# EAGLE design Xtriker_Laser (EAGLE 9.6.0)
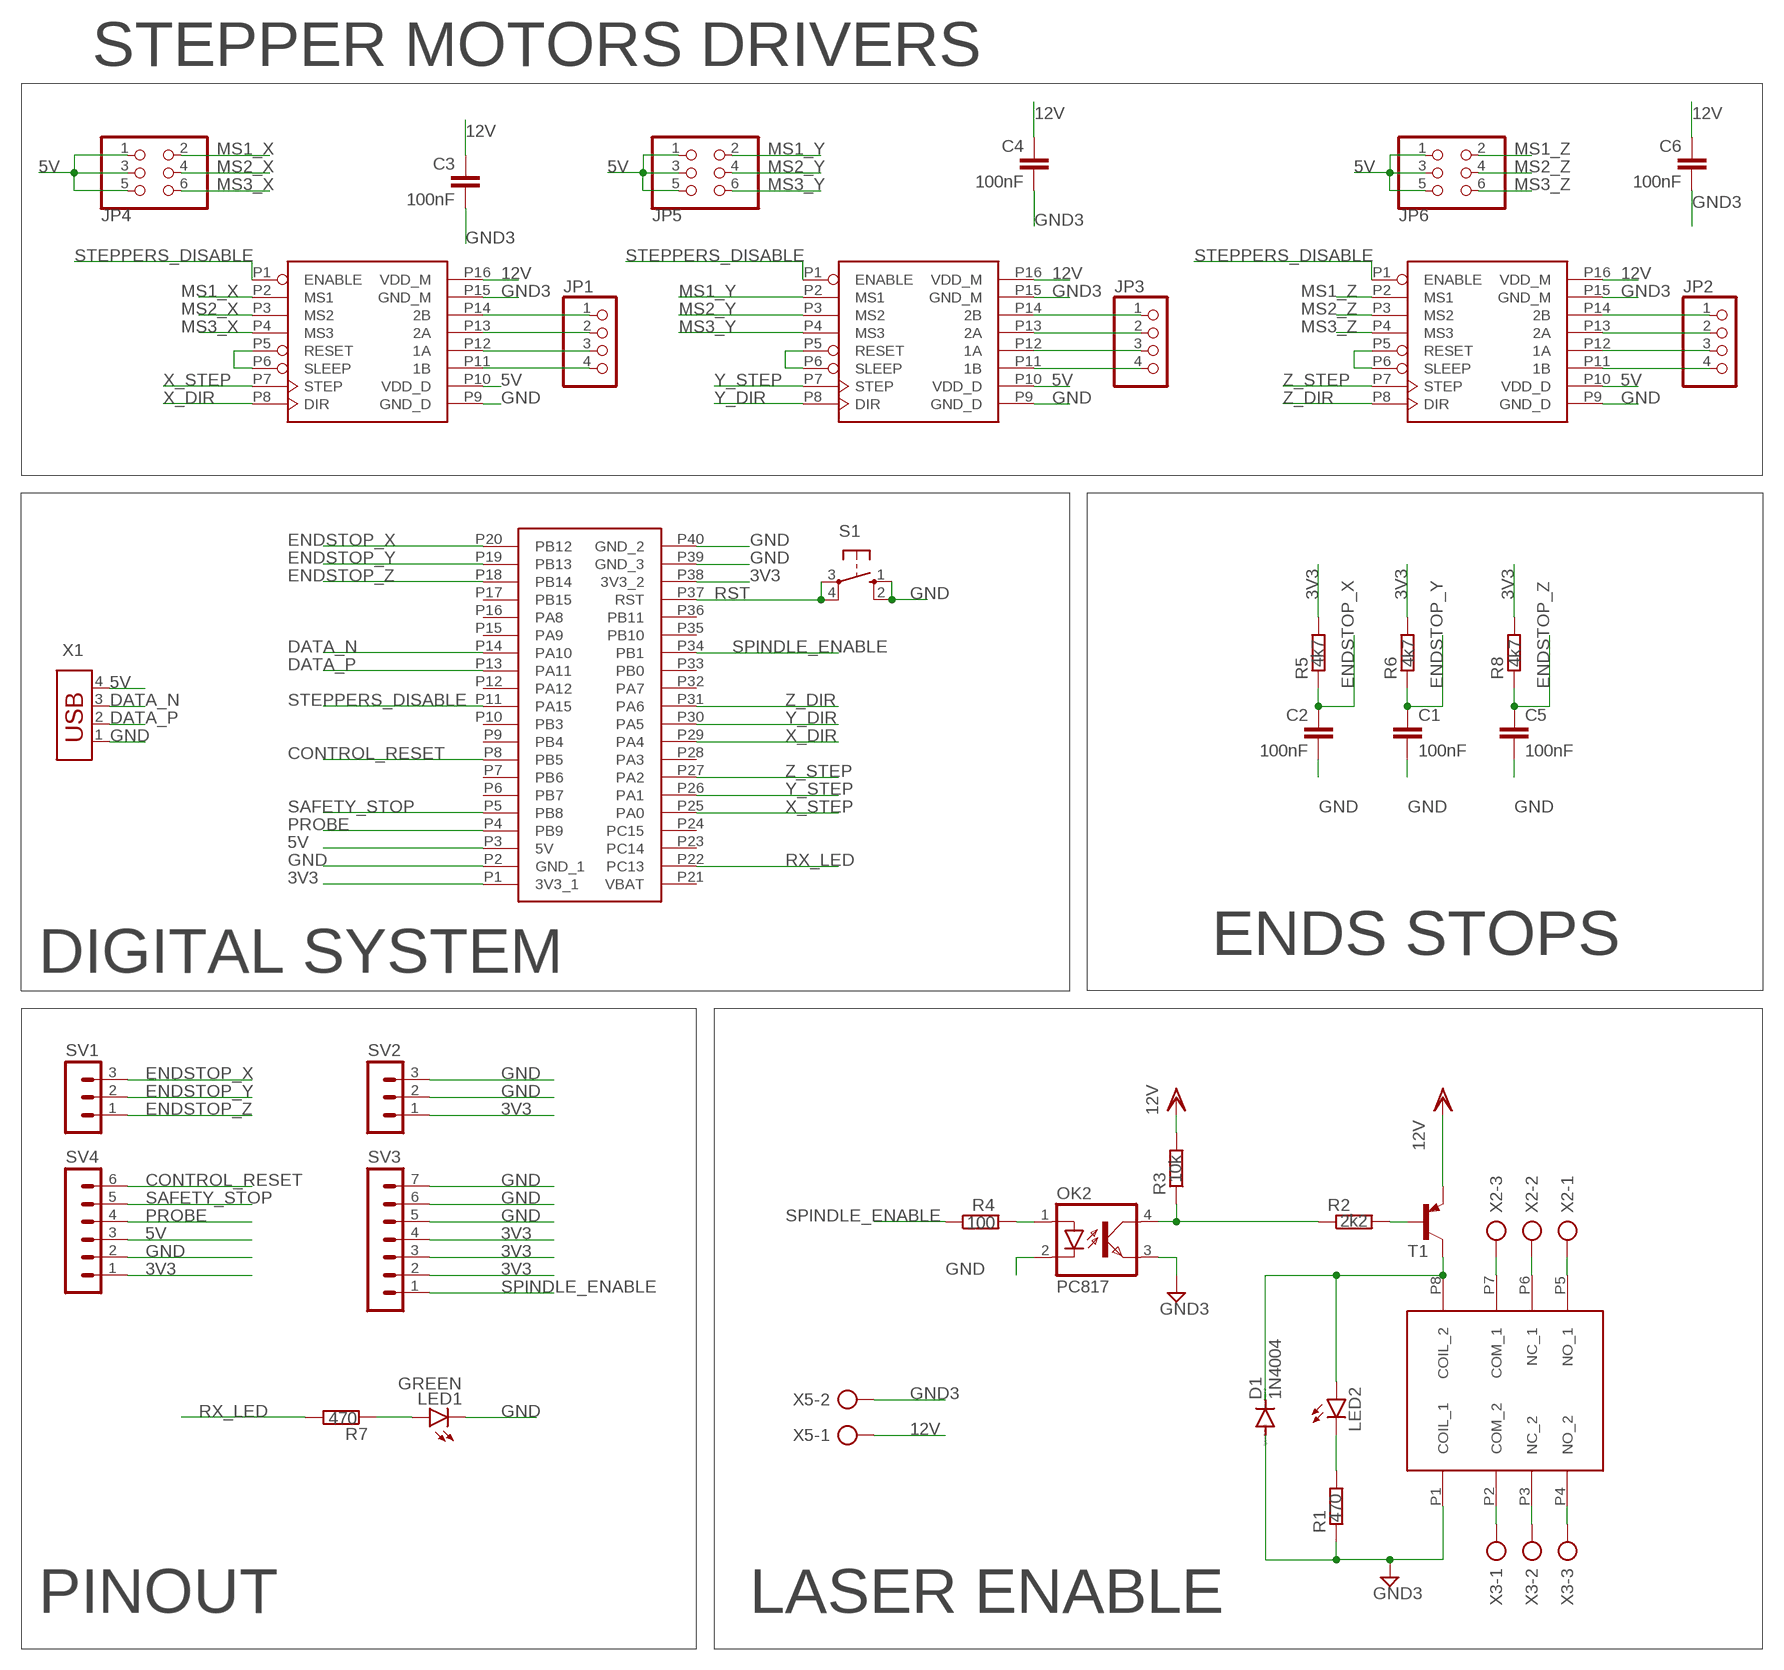
[diagram p0: schematic, sheet 1]

## Parts
C1  100nF  C-EUC0805  [C0805]
C2  100nF  C-EUC0805  [C0805]
C3  100nF  C-EUC0805  [C0805]
C4  100nF  C-EUC0805  [C0805]
C5  100nF  C-EUC0805  [C0805]
C6  100nF  C-EUC0805  [C0805]
D1  1N4004  [DO41-10]
JP1  PINHD-1X4  [1X04]
JP2  PINHD-1X4  [1X04]
JP3  PINHD-1X4  [1X04]
JP4  PINHD-2X3  [2X03]
JP5  PINHD-2X3  [2X03]
JP6  PINHD-2X3  [2X03]
LED1  GREEN  LED3MM  [LED3MM]
LED2  LED3MM  [LED3MM]
OK2  PC817  [DIL04]
R1  470  R-EU_R0805  [R0805]
R2  2k2  R-EU_R0805  [R0805]
R3  10k  R-EU_R0805  [R0805]
R4  100  R-EU_R0805  [R0805]
R5  4k7  R-EU_R0805  [R0805]
R6  4k7  R-EU_R0805  [R0805]
R7  470  R-EU_R0805  [R0805]
R8  4k7  R-EU_R0805  [R0805]
S1  10-XX  [B3F-10XX]
SV1  MA03-1  [MA03-1]
SV2  MA03-1  [MA03-1]
SV3  MA07-1  [MA07-1]
SV4  MA06-1  [MA06-1]
T1  -PNP-SOT23-BCE  [SOT23-BCE]
U$1  A4988  [A4988]
U$2  A4988  [A4988]
U$3  A4988  [A4988]
U$4  BLUEPILL_STM32F103C8  [BLUEPILL_STM32F103C8]
U$5  TDS-1202L  [TDS_1202L]
X1  USB-787616  [USB]
X2  AK500/3  [AK500/3]
X3  AK500/3  [AK500/3]
X5  AK500/2  [AK500/2]

## Nets
3V3: R5.2 R6.2 R8.2 SV2.1 SV3.2 SV3.3 SV3.4 SV4.1 U$4.P1(3V3_1) U$4.P38(3V3_2)
5V: JP4.1 JP4.3 JP4.5 JP5.1 JP5.3 JP5.5 JP6.1 JP6.3 JP6.5 SV4.3 U$1.P10(VDD_D) U$2.P10(VDD_D) U$3.P10(VDD_D) U$4.P3(5V) X1.4
12V: C3.1 C4.1 C6.1 U$1.P16(VDD_M) U$2.P16(VDD_M) U$3.P16(VDD_M) X5.1
CONTROL_RESET: SV4.6 U$4.P8(PB5)
DATA_N [Diff]: U$4.P14(PA10) X1.3
DATA_P [Diff]: U$4.P13(PA11) X1.2
ENDSTOP_X: C2.1 R5.1 SV1.3 U$4.P20(PB12)
ENDSTOP_Y: C1.1 R6.1 SV1.2 U$4.P19(PB13)
ENDSTOP_Z: C5.1 R8.1 SV1.1 U$4.P18(PB14)
GND: C1.2 C2.2 C5.2 LED1.K(C) OK2.2(C) S1.1(S) S1.2(S1) SV2.2 SV2.3 SV3.5 SV3.6 SV3.7 SV4.2 U$1.P9(GND_D) U$2.P9(GND_D) U$3.P9(GND_D) U$4.P2(GND_1) U$4.P39(GND_3) U$4.P40(GND_2) X1.1
GND3: C3.2 C4.2 C6.2 D1.A OK2.3(EMIT) R1.1 U$1.P15(GND_M) U$2.P15(GND_M) U$3.P15(GND_M) U$5.P1(COIL_1) X5.2
MS1_X: JP4.2 U$1.P2(MS1)
MS1_Y: JP5.2 U$3.P2(MS1)
MS1_Z: JP6.2 U$2.P2(MS1)
MS2_X: JP4.4 U$1.P3(MS2)
MS2_Y: JP5.4 U$3.P3(MS2)
MS2_Z: JP6.4 U$2.P3(MS2)
MS3_X: JP4.6 U$1.P4(MS3)
MS3_Y: JP5.6 U$3.P4(MS3)
MS3_Z: JP6.6 U$2.P4(MS3)
N$1: JP2.4 U$2.P11(1B)
N$2: JP2.3 U$2.P12(1A)
N$3: JP2.2 U$2.P13(2A)
N$4: JP2.1 U$2.P14(2B)
N$5: JP3.4 U$3.P11(1B)
N$6: JP3.3 U$3.P12(1A)
N$7: JP3.2 U$3.P13(2A)
N$8: JP3.1 U$3.P14(2B)
N$9: JP1.4 U$1.P11(1B)
N$10: JP1.3 U$1.P12(1A)
N$11: JP1.2 U$1.P13(2A)
N$13: D1.C LED2.A T1.C U$5.P8(COIL_2)
N$14: LED2.K(C) R1.2
N$15: R2.2 T1.B
N$16: OK2.4(COL) R2.1 R3.1
N$17: OK2.1(A) R4.2
N$26: U$1.P5(RESET) U$1.P6(SLEEP)
N$27: U$3.P5(RESET) U$3.P6(SLEEP)
N$28: U$2.P5(RESET) U$2.P6(SLEEP)
N$29: U$5.P5(NO_1) X2.1
N$30: U$5.P6(NC_1) X2.2
N$31: U$5.P7(COM_1) X2.3
N$32: U$5.P4(NO_2) X3.3
N$33: U$5.P3(NC_2) X3.2
N$34: U$5.P2(COM_2) X3.1
N$35: LED1.A R7.1
PROBE: SV4.4 U$4.P4(PB9)
RST: S1.3(P) S1.4(P1) U$4.P37(RST)
RX_LED: R7.2 U$4.P22(PC13)
SAFETY_STOP: SV4.5 U$4.P5(PB8)
SMX_2B: JP1.1 U$1.P14(2B)
SPINDLE_ENABLE: R4.1 SV3.1 U$4.P34(PB1)
STEPPERS_DISABLE: U$1.P1(ENABLE) U$2.P1(ENABLE) U$3.P1(ENABLE) U$4.P11(PA15)
VDD: R3.2 T1.E ; supply symbol labelled 12V
X_DIR: U$1.P8(DIR) U$4.P29(PA4)
X_STEP: U$1.P7(STEP) U$4.P25(PA0)
Y_DIR: U$3.P8(DIR) U$4.P30(PA5)
Y_STEP: U$3.P7(STEP) U$4.P26(PA1)
Z_DIR: U$2.P8(DIR) U$4.P31(PA6)
Z_STEP: U$2.P7(STEP) U$4.P27(PA2)
Unconnected: U$4.P6(PB7) U$4.P7(PB6) U$4.P9(PB4) U$4.P10(PB3) U$4.P12(PA12) U$4.P15(PA9) U$4.P16(PA8) U$4.P17(PB15) U$4.P23(PC14) U$4.P24(PC15) U$4.P28(PA3) U$4.P32(PA7) U$4.P33(PB0) U$4.P35(PB10) U$4.P36(PB11)

## Notes on the sheet
- STEPPER MOTORS DRIVERS
- DIGITAL SYSTEM | ENDS STOPS
- PINOUT | LASER ENABLE

## Power pins joined to a net without a drawn wire
VBAT: U$4.P21(VBAT)

## Library data of the parts
C1-C6 = rcl:C-EU: CAPACITOR, European symbol; SPICEPREFIX: C
D1 = diode:1N4004: DIODE general purpose rectifier, 1 A
JP1-JP3 = pinhead:PINHD-1X4: PIN HEADER
JP4-JP6 = pinhead:PINHD-2X3: PIN HEADER
LED1 LED2 = led:LED: LED OSRAM: - CHIPLED LG R971, LG N971, LY N971, LG Q971, LY Q971, LO R971, LY R971 LH N974, LH R974 LS Q976, LO Q976, LY Q976 LO Q996 - Hyper CHIPLED LW Q18S LB Q993, LB Q99A, LB R99A - SideLED LS A670, LO A670, LY A670, LG A670, LP A670 LB A673, LV A673, LT A673, LW A673 LH A674 LY A675 LS A676, LA A676, LO A676, LY A676, LW A676 LS A679, LY A679, LG A679 - Hyper Micro SIDELED® LS Y876, LA Y876, LO Y876, LY Y876 LT Y87S - SmartLED LW L88C, LW L88S LB L89C, LB L89S, LG L890 LS L89K, LO L89K, LY L89K LS L896, LA L896, LO L896, LY L896 - TOPLED LS T670, LO T670, LY T670, LG T670, LP T670 LSG T670, LSP T670, LSY T670, LOP T670, LYG T670 LG T671, LOG T671, LSG T671 LB T673, LV T673, LT T673, LW T673 LH T674 LS T676, LA T676, LO T676, LY T676, LB T676, LH T676, LSB T676, LW T676 LB T67C, LV T67C, LT T67C, LS T67K, LO T67K, LY T67K, LW E67C LS E67B, LA E67B, LO E67B, LY E67B, LB E67C, LV E67C, LT E67C LW T67C LS T679, LY T679, LG T679 LS T770, LO T770, LY T770, LG T770, LP T770 LB T773, LV T773, LT T773, LW T773 LH T774 LS E675, LA E675, LY E675, LS T675 LS T776, LA T776, LO T776, LY T776, LB T776 LHGB T686 LT T68C, LB T68C - Hyper Mini TOPLED® LB M676 - Mini TOPLED Santana® LG M470 LS M47K, LO M47K, LY M47K Source: http://www.osram.convergy.de LUXEON: - LUMILED® LXK2-PW12-R00, LXK2-PW12-S00, LXK2-PW14-U00, LXK2-PW14-V00 LXK2-PM12-R00, LXK2-PM12-S00, LXK2-PM14-U00 LXK2-PE12-Q00, LXK2-PE12-R00, LXK2-PE12-S00, LXK2-PE14-T00, LXK2-PE14-U00 LXK2-PB12-K00, LXK2-PB12-L00, LXK2-PB12-M00, LXK2-PB14-N00, LXK2-PB14-P00, LXK2-PB14-Q00 LXK2-PR12-L00, LXK2-PR12-M00, LXK2-PR14-Q00, LXK2-PR14-R00 LXK2-PD12-Q00, LXK2-PD12-R00, LXK2-PD12-S00 LXK2-PH12-R00, LXK2-PH12-S00 LXK2-PL12-P00, LXK2-PL12-Q00, LXK2-PL12-R00 Source: www.luxeon.com KINGBRIGHT: KA-3528ASYC Source: www.kingbright.com
OK2 = optocoupler:PC817: SHARP OPTO COUPLER; MPN: PC817X4J000F; OC_FARNELL: 9707727; OC_NEWARK: 97K7059
R1-R8 = rcl:R-EU_: RESISTOR, European symbol; SPICEPREFIX: R
S1 = switch-omron:10-XX: OMRON SWITCH; MPN: B3F-1000; OC_FARNELL: 176432; OC_NEWARK: 36M3542
SV1 SV2 = con-lstb:MA03-1: PIN HEADER; OC_FARNELL: unknown; OC_NEWARK: unknown
SV3 = con-lstb:MA07-1: PIN HEADER; OC_FARNELL: unknown; OC_NEWARK: unknown
SV4 = con-lstb:MA06-1: PIN HEADER; OC_FARNELL: unknown; OC_NEWARK: unknown
T1 = transistor:*-PNP-: PNP Transistror
U$1-U$3 = A4988:A4988
U$4 = BluePill_STM32F103:BLUEPILL_STM32F103C8
U$5 = TDS-1202L:TDS-1202L
X1 = con-amp:USB-787616: AMP connector
X2 X3 = con-ptr500:AK500/3: CONNECTOR; OC_FARNELL: unknown; OC_NEWARK: unknown
X5 = con-ptr500:AK500/2: CONNECTOR; OC_FARNELL: unknown; OC_NEWARK: unknown

## Net classes
1 Diff: width 1.27 mm

## Board
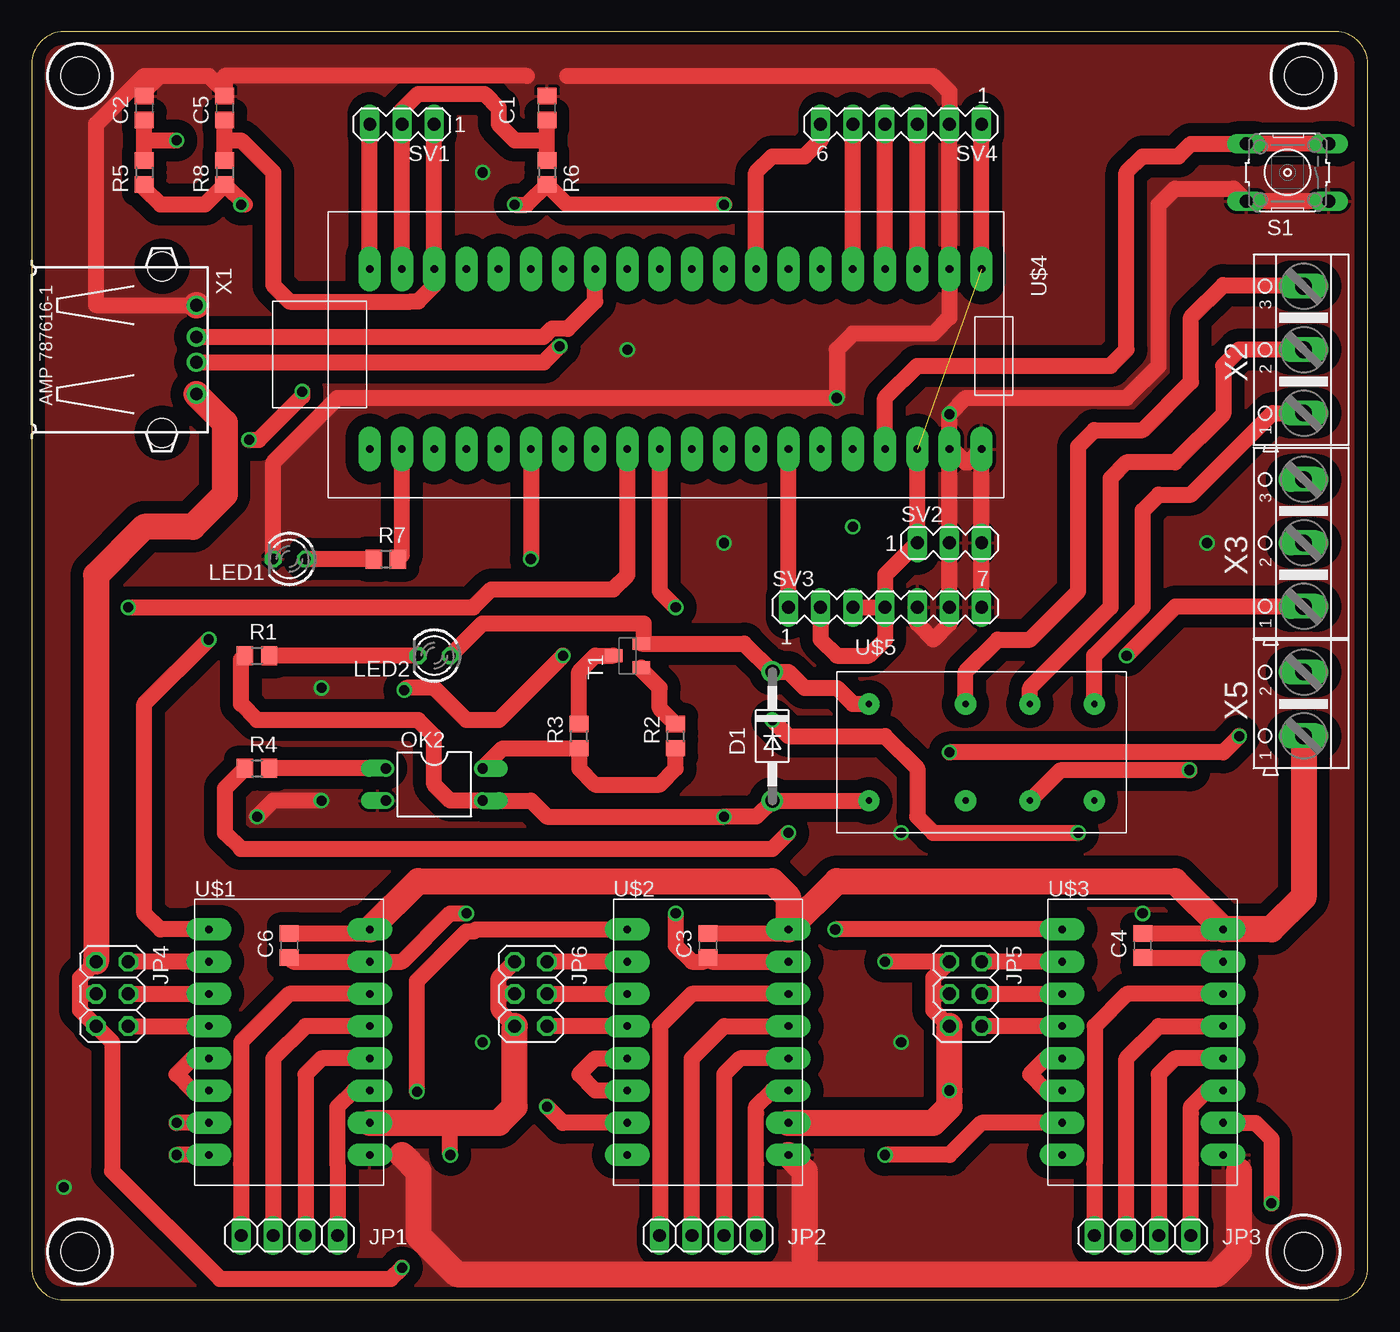
[diagram p1: board, top side]
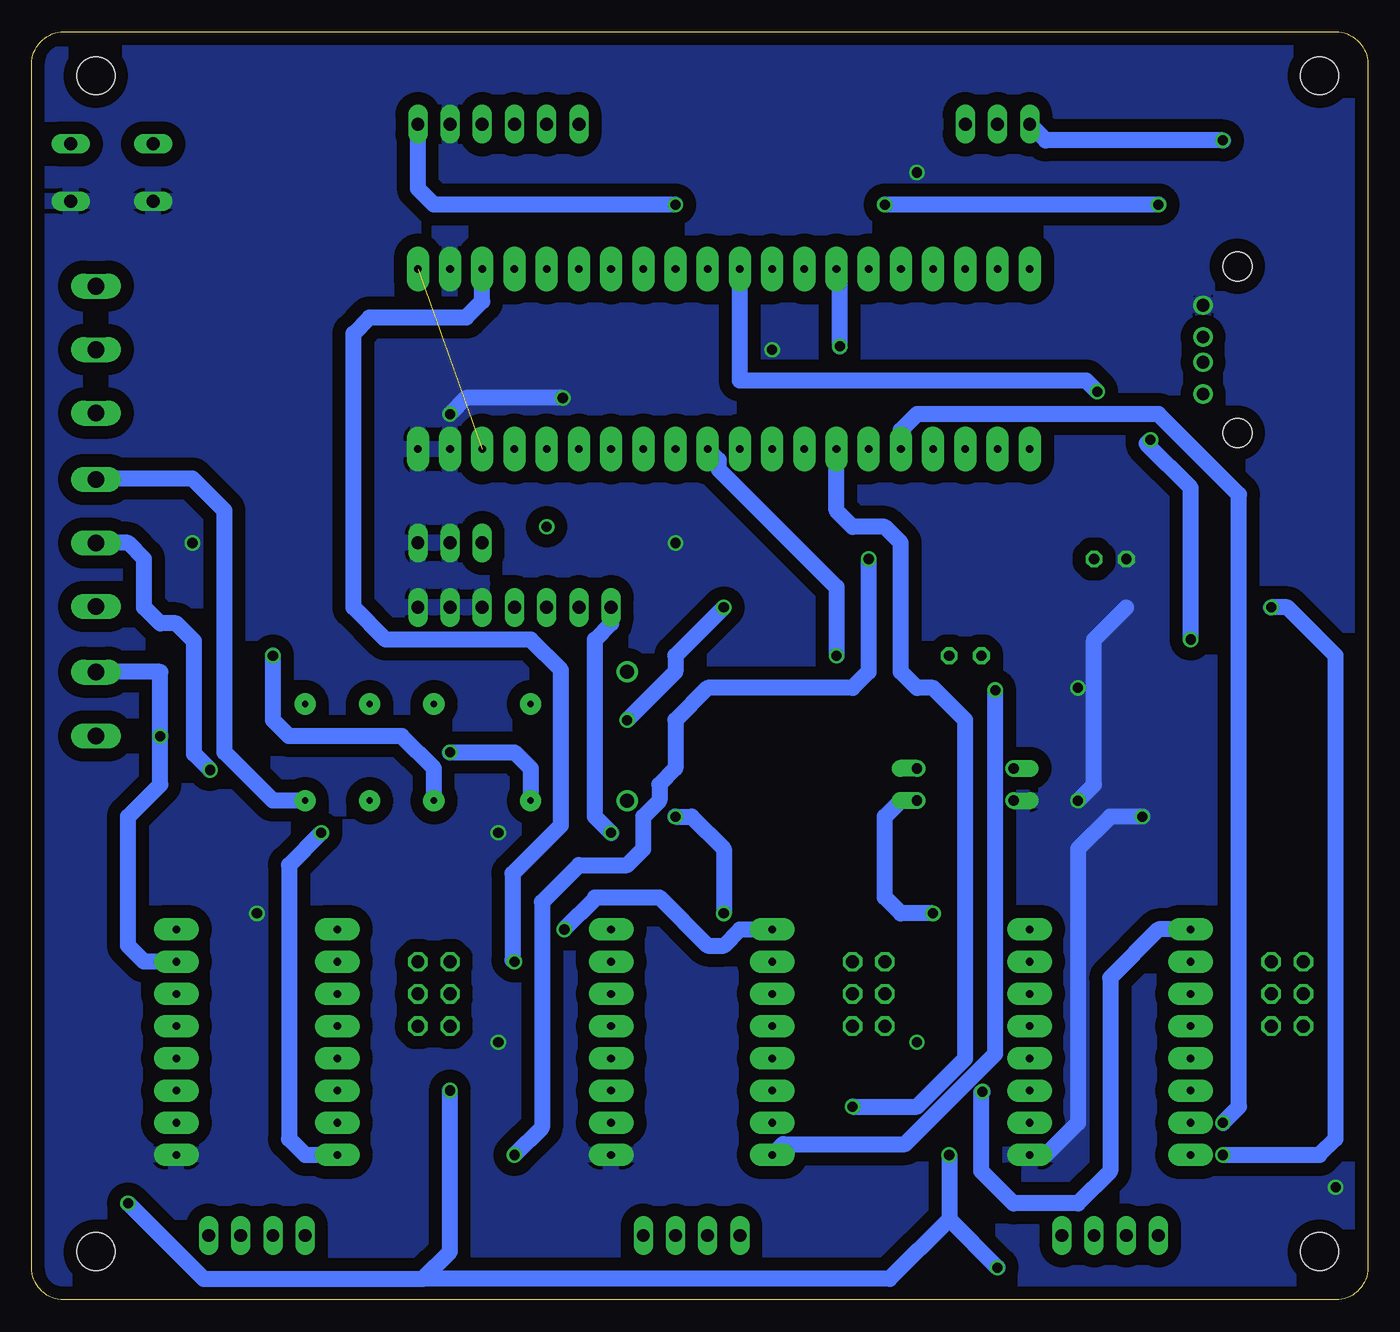
[diagram p2: board, bottom side, seen from below]

Size 105.39 x 100 mm. Coordinates in mm from the lower left corner, seen from the top.
Outline: 2.54,0 102.85,0 arc90 105.39,2.54 105.39,97.46 arc90 102.85,100 2.54,100 arc90 0,97.46 0,2.54 arc90 2.54,0
Copper layers (1*16): Top 0.035mm / dielectric 1.5mm / Bottom 0.035mm
Design rules "default *": minimum track width 6mil, minimum drill 0.8mm, track to track 6mil, track to pad 6mil, pad to pad 6mil, via to via 6mil, smd to smd 6mil, copper to edge 40mil, drill to drill 6mil, minimum pad ring 10mil, minimum via ring 8mil, stop-mask expansion 4mil, vias tented up to drill 0mil, thermal gap 10mil
Holes 3 mm at 100.33,96.52 100.33,3.81 3.81,3.81 3.81,96.52

### Footprints (pad centres in the part's own frame; a part is rotated, then mirrored left to right if it is on the bottom)
C0805 = smd 1.3 x 1.5: 1 -0.95,0; 2 0.95,0
DO41-10 = drill 1.118: A 5.08,0; C -5.08,0
1X04 = drill 1.016 long: 1 -3.81,0; 2 -1.27,0; 3 1.27,0; 4 3.81,0
2X03 = drill 1.016 octagon: 1 -2.54,-1.27; 2 -2.54,1.27; 3 0,-1.27; 4 0,1.27; 5 2.54,-1.27; 6 2.54,1.27
LED3MM = drill 0.813 octagon: A -1.27,0; K 1.27,0
DIL04 = drill 0.813 offset: 1 -1.27,-3.81; 2 1.27,-3.81; 3 1.27,3.81; 4 -1.27,3.81
R0805 = smd 1.3 x 1.5: 1 -0.95,0; 2 0.95,0
B3F-10XX = drill 1.016 long: 1 -3.251,2.261; 2 3.251,2.261; 3 -3.251,-2.261; 4 3.251,-2.261
MA03-1 = drill 1.016 long: 1 -2.54,0; 2 0,0; 3 2.54,0
MA07-1 = drill 1.016 long: 1 -7.62,0; 2 -5.08,0; 3 -2.54,0; 4 0,0; 5 2.54,0; 6 5.08,0; 7 7.62,0
MA06-1 = drill 1.016 long: 1 -6.35,0; 2 -3.81,0; 3 -1.27,0; 4 1.27,0; 5 3.81,0; 6 6.35,0
SOT23-BCE = smd 1 x 1.4: B -0.95,-1.1; C 0.95,-1.1; E 0,1.1
A4988 = drill 0.6 pad 1.778 long: P1 -6.35,7.62; P2 -6.35,5.08; P3 -6.35,2.54; P4 -6.35,0; P5 -6.35,-2.54; P6 -6.35,-5.08; P7 -6.35,-7.62; P8 -6.35,-10.16; P9 6.35,-10.16; P10 6.35,-7.62; P11 6.35,-5.08; P12 6.35,-2.54; P13 6.35,0; P14 6.35,2.54; P15 6.35,5.08; P16 6.35,7.62
BLUEPILL_STM32F103C8 = drill 0.6 pad 1.778 long: P1 -6.35,20.32; P2 -6.35,17.78; P3 -6.35,15.24; P4 -6.35,12.7; P5 -6.35,10.16; P6 -6.35,7.62; P7 -6.35,5.08; P8 -6.35,2.54; P9 -6.35,0; P10 -6.35,-2.54; P11 -6.35,-5.08; P12 -6.35,-7.62; P13 -6.35,-10.16; P14 -6.35,-12.7; P15 -6.35,-15.24; P16 -6.35,-17.78; P17 -6.35,-20.32; P18 -6.35,-22.86; P19 -6.35,-25.4; P20 -6.35,-27.94; P21 7.849,-27.94; P22 7.849,-25.4; P23 7.849,-22.86; P24 7.849,-20.32; P25 7.849,-17.78; P26 7.849,-15.24; P27 7.849,-12.7; P28 7.849,-10.16; P29 7.849,-7.62; P30 7.849,-5.08; P31 7.849,-2.54; P32 7.849,0; P33 7.849,2.54; P34 7.849,5.08; P35 7.849,7.62; P36 7.849,10.16; P37 7.849,12.7; P38 7.849,15.24; P39 7.849,17.78; P40 7.849,20.32
TDS_1202L = drill 0.5 pad 1.676: P1 -2.54,-2.54; P2 5.08,-2.54; P3 10.16,-2.54; P4 15.24,-2.54; P5 15.24,5.08; P6 10.16,5.08; P7 5.08,5.08; P8 -2.54,5.08
USB = drill 1: 1 -3.5,12.99; 2 -1,12.99; 3 1,12.99; 4 3.5,12.99 | hole 2.3: -6.57,10.28; 6.57,10.28
AK500/3 = drill 1.321 long: 1 -5.004,0; 2 0,0; 3 5.004,0
AK500/2 = drill 1.321 long: 1 -2.515,0; 2 2.515,0

### Placement (x,y rotation side)
C1  40.64,93.98 90 top
C2  8.89,93.98 90 top
C3  53.34,27.94 270 top
C4  87.63,27.94 270 top
C5  15.24,93.98 90 top
C6  20.32,27.94 270 top
D1  58.42,44.45 270 top
JP1  20.32,5.08 0 top
JP2  53.34,5.08 0 top
JP3  87.63,5.08 0 top
JP4  6.35,24.13 270 top
JP5  73.66,24.13 270 top
JP6  39.37,24.13 270 top
LED1  20.32,58.42 180 top
LED2  31.75,50.8 180 top
OK2  31.75,40.64 270 top
R1  17.78,50.8 0 top
R2  50.8,44.45 90 top
R3  43.18,44.45 90 top
R4  17.78,41.91 0 top
R5  8.89,88.9 270 top
R6  40.64,88.9 270 top
R7  27.94,58.42 0 top
R8  15.24,88.9 270 top
S1  99.06,88.9 180 top
SV1  29.21,92.71 180 top
SV2  72.39,59.69 0 top
SV3  67.31,54.61 0 top
SV4  68.58,92.71 180 top
T1  46.99,50.8 90 top
U$1  20.32,21.59 0 top
U$2  53.34,21.59 0 top
U$3  87.63,21.59 0 top
U$4  54.61,74.93 270 top
U$5  68.58,41.91 0 top
X1  0,74.93 270 top
X2  100.33,74.93 90 top
X3  100.33,59.69 90 top
X5  100.33,46.99 90 top

### Tracks (layer width: path | path; a pad name or v marks a point on that pad's centre or on a via)
3V3  (via drill 0.8)  (1 unrouted)
  Top 1.27: v16.51,86.36 16.83,86.36 R8.2 13.65,86.36 10.16,86.36 8.89,87.63 R5.2 | v38.1,86.36 39.05,86.36 R6.2 42.23,86.36 v54.61,86.36 | SV3.2 62.23,52.07 63.5,50.8 66.04,50.8 67.31,52.07 SV3.4 | U$4.P1 SV4.1 | U$4.P38 SV2.1 67.31,57.15 SV3.4 | SV3.3 SV3.4
  Bottom 1.27: v16.51,86.36 v38.1,86.36 | v54.61,86.36 73.66,86.36 74.93,87.63 SV4.1
5V  (via drill 0.8)
  Top 1.27: U$4.P3 SV4.3 | 3.81,24.13 3.81,22.86 JP4.5 6.35,20.32 6.35,10.16 14.86,1.65 28.32,1.65 v29.21,2.54 | 3.81,24.13 3.81,25.4 JP4.1 | JP4.3 3.81,24.13 | JP5.5 71.12,22.86 71.12,24.13 | 71.12,24.13 71.12,25.4 JP5.1 v67.31,26.67 | JP5.3 71.12,24.13 | JP6.5 36.83,22.86 36.83,24.13 | 36.83,24.13 36.83,25.4 JP6.1 | JP6.3 36.83,24.13 | U$3.P10 96.52,13.97 97.79,12.7 v97.79,7.62 | v33.02,11.43 33.02,13.97
  Top 2.032: JP6.5 38.1,15.24 36.83,13.97 33.02,13.97 U$1.P10 | JP5.5 v72.39,16.51 72.39,15.24 71.12,13.97 U$2.P10 | X1.4 15.24,69.18 15.24,63.5 12.7,60.96 8.89,60.96 5.08,57.15 JP4.1
  Bottom 1.27: v97.79,7.62 91.82,1.65 74.55,1.65 | 74.55,1.65 72.39,3.81 v72.39,16.51 | v33.02,11.43 33.02,6.35 | v29.21,2.54 33.02,6.35 | 33.02,6.35 37.72,1.65 74.55,1.65 | v67.31,26.67 67.46,26.82 67.46,33.61 63.65,37.42 63.65,49.68 66.04,52.07 77.47,52.07 80.01,54.61 80.01,76.2 78.74,77.47 71.12,77.47 69.85,78.74 U$4.P3
12V
  Top 1.27: U$1.P16 26.35,28.89 C6.1 | U$2.P16 59.37,28.89 C3.1 | U$3.P16 93.66,28.89 C4.1
  Top 2.032: X5.1 100.33,31.75 97.79,29.21 U$3.P16 90.17,33.02 63.5,33.02 U$2.P16 59.69,31.75 58.42,33.02 30.48,33.02 U$1.P16
CONTROL_RESET
  Top 1.27: U$4.P8 57.15,88.9 58.42,90.17 60.96,90.17 62.23,91.44 SV4.6
DATA_N  (via drill 0.8)
  Top 1.27: X1.3 40.38,73.93 v41.65,75.19
  Bottom 1.27: v41.65,75.19 41.65,81.02 U$4.P14
DATA_P
  Top 1.27: X1.2 40.37,75.93 | 40.37,75.93 40.64,76.2 | 40.37,75.93 | 40.37,75.93 41.06,76.62 42.23,76.62 42.28,76.57 44.45,78.74 U$4.P13
ENDSTOP_X  (via drill 0.8)
  Top 1.27: U$4.P20 SV1.3 | R5.1 8.89,91.44 | 8.89,91.44 C2.1 | 8.89,91.44 v11.43,91.44
  Bottom 1.27: SV1.3 25.4,91.44 v11.43,91.44
ENDSTOP_Y
  Top 1.27: R6.1 40.64,91.44 | 40.64,91.44 C1.1 | U$4.P19 SV1.2 29.21,93.83 30.48,95.1 35.71,95.1 36.83,93.98 36.83,92.71 38.1,91.44 40.64,91.44
ENDSTOP_Z
  Top 1.27: SV1.1 U$4.P18 31.75,80.01 30.48,78.74 29.93,78.74 29.9,78.72 20.34,78.72 19.05,80.01 19.05,88.9 16.51,91.44 15.24,91.44 | R8.1 15.24,91.44 | 15.24,91.44 C5.1
GND  (via drill 0.8)
  Top 1.27: LED1.K 19.05,66.04 24.13,71.12 v63.5,71.12 63.5,74.93 64.77,76.2 71.12,76.2 72.39,77.47 U$4.P2 SV4.2 72.39,95.25 71.12,96.52 42.23,96.52 | SV3.5 69.85,53.34 71.12,52.07 72.39,53.34 | S1.1 S1.2 94.82,87.63 90.17,87.63 88.9,86.36 88.9,73.66 86.36,71.12 73.66,71.12 v72.39,69.85 U$4.P39 72.62,67.08 | 8.89,95.25 10.16,96.52 | 10.16,96.52 13.97,96.52 15.24,95.25 15.24,96.52 39.05,96.52 | 10.16,96.52 8.89,96.52 5.08,92.71 5.08,78.44 12.97,78.44 | v22.86,39.37 19.05,39.37 v17.78,38.1 | 72.62,67.08 73.66,66.04 73.89,66.04 U$4.P40 SV2.3 SV3.7 | 72.62,67.08 72.39,66.85 SV2.2 SV3.6
  Top 2.032: X1.1 12.97,78.44 | 29.21,11.43 30.48,10.16 30.48,5.08 33.53,2.03 60.96,2.03 | 95.25,10.16 95.25,3.81 93.47,2.03 60.96,2.03 | U$2.P9 60.96,10.16 60.96,2.03
  Bottom 1.27: v72.39,69.85 71.12,71.12 v63.5,71.12 | v22.86,39.37 21.59,40.64 21.59,52.07 19.05,54.61 | U$1.P9 25.4,11.43 22.86,13.97 22.86,35.56 20.32,38.1 v17.78,38.1
  other vias: 68.58,20.32 87.63,30.48 92.71,59.69 46.99,74.93 2.54,8.89 35.56,88.9 68.58,36.83 22.86,48.26 54.61,59.69
  pour Top (isolate 1.016): 105.41,0 0,0 0,100.33 105.41,100.33
  pour Bottom (isolate 1.016): 0,100.33 105.41,100.33 105.41,0 0,0
GND3  (via drill 0.8)
  Top 1.27: U$5.P1 D1.A 57.15,38.1 v54.61,38.1 40.64,38.1 39.37,39.37 OK2.3 33.02,39.37 31.75,40.64 31.75,44.45 30.48,45.72 17.78,45.72 16.51,46.99 16.51,50.48 R1.1 | C6.2 20.64,26.67 U$1.P15 29.21,26.67 33.02,30.48 v34.29,30.48 | U$2.P15 53.66,26.67 C3.2 53.02,26.67 52.07,26.67 50.8,27.94 v50.8,30.48 | C4.2 93.66,26.99 U$3.P15 | v95.25,44.45 93.98,43.18 v72.39,43.18
  Bottom 1.27: U$3.P15 96.52,26.67 97.79,27.94 97.79,38.1 95.25,40.64 v95.25,44.45 95.25,49.53 100.31,49.53 X5.2 | v54.61,38.1 53.34,38.1 50.8,35.56 v50.8,30.48 | v34.29,30.48 36.83,30.48 38.1,31.75 38.1,38.1 36.83,39.37 OK2.3 | U$5.P1 66.04,41.91 67.31,43.18 v72.39,43.18
MS1_X
  Top 1.27: U$1.P2 JP4.2
MS1_Y
  Top 1.27: U$3.P2 JP5.2
MS1_Z
  Top 1.27: U$2.P2 JP6.2
MS2_X
  Top 1.27: JP4.4 U$1.P3
MS2_Y
  Top 1.27: JP5.4 U$3.P3
MS2_Z
  Top 1.27: JP6.4 U$2.P3
MS3_X
  Top 1.27: JP4.6 U$1.P4
MS3_Y
  Top 1.27: U$3.P4 JP5.6
MS3_Z
  Top 1.27: U$2.P4 JP6.6
N$1
  Top 1.27: JP2.4 57.15,10.71 57.12,10.74 57.12,14.66 57.15,14.69 57.15,15.24 58.42,16.51 U$2.P11
N$2
  Top 1.27: U$2.P12 55.88,19.05 54.61,17.78 JP2.3
N$3
  Top 1.27: JP2.2 52.07,19.05 54.61,21.59 U$2.P13
N$4
  Top 1.27: U$2.P14 52.07,24.13 49.55,21.61 49.55,5.11 JP2.1
N$5
  Top 1.27: JP3.4 91.44,10.71 91.42,10.74 91.42,14.66 91.44,14.69 91.44,15.24 92.71,16.51 U$3.P11
N$6
  Top 1.27: U$3.P12 90.17,19.05 88.9,17.78 JP3.3
N$7
  Top 1.27: JP3.2 86.36,19.05 88.9,21.59 U$3.P13
N$8
  Top 1.27: JP3.1 83.82,10.71 83.84,10.74 83.84,21.59 86.39,24.13 U$3.P14
N$9
  Top 1.27: U$1.P11 25.4,16.51 24.11,15.21 24.11,10.74 24.13,10.71 JP1.4
N$10
  Top 1.27: U$1.P12 22.86,19.05 21.59,17.78 JP1.3
N$11
  Top 1.27: U$1.P13 21.59,21.59 19.05,19.05 JP1.2
N$13
  Top 1.27: U$5.P8 64.77,46.99 63.5,48.26 60.96,48.26 59.69,49.53 D1.C 56.2,51.75 T1.C 48.26,51.92 48.26,53.34 35.56,53.34 LED2.A
N$14
  Top 1.27: LED2.K R1.2
N$15
  Top 1.27: R2.2 49.53,46.67 49.53,48.26 48.09,49.7 T1.B
N$16
  Top 1.27: OK2.4 37.15,43.5 R3.1 43.18,41.91 44.45,40.64 49.53,40.64 50.8,41.91 R2.1
N$17
  Top 1.27: OK2.1 R4.2
N$18  (via drill 0.8)
  other vias: 35.56,20.32
N$20  (via drill 0.8)
  other vias: 64.77,60.96
N$26
  Top 1.27: U$1.P6 12.7,16.51 11.43,17.78 12.7,19.05 U$1.P5
N$27
  Top 1.27: U$3.P6 80.01,16.51 78.74,17.78 80.01,19.05 U$3.P5
N$28
  Top 1.27: U$2.P6 44.45,16.51 43.18,17.78 44.45,19.05 U$2.P5
N$29
  Top 1.27: X2.1 97.87,69.93 91.44,63.5 88.9,63.5 87.63,62.23 87.63,54.61 83.82,50.8 U$5.P5
N$30
  Top 1.27: X2.2 95.25,74.93 93.98,73.66 93.98,69.85 90.17,66.04 86.36,66.04 85.09,64.77 85.09,54.61 78.74,48.26 U$5.P6
N$31
  Top 1.27: U$5.P7 73.66,49.53 76.2,52.07 78.74,52.07 82.55,55.88 82.55,67.31 83.82,68.58 87.63,68.58 91.44,72.39 91.44,77.47 93.98,80.01 100.25,80.01 X2.3
N$32
  Bottom 1.27: U$5.P4 86.36,39.37 90.17,43.18 90.17,62.23 92.71,64.77 100.25,64.77 X3.3
N$33  (via drill 0.8)
  Top 1.27: U$5.P3 81.13,41.76 91.32,41.76 v91.32,41.79
  Bottom 1.27: X3.2 97.79,59.69 96.52,58.42 96.52,54.61 95.25,53.34 93.98,53.34 92.59,51.95 92.59,43.06 v91.32,41.79
N$34  (via drill 0.8)
  Top 1.27: v86.36,50.8 90.25,54.69 X3.1
  Bottom 1.27: U$5.P2 73.66,41.91 76.2,44.45 85.09,44.45 86.36,45.72 v86.36,50.8
N$35
  Top 1.27: R7.1 LED1.A
PROBE
  Top 1.27: U$4.P4 SV4.4
RST
  Top 1.27: U$4.P37 67.31,71.12 69.85,73.66 85.09,73.66 86.36,74.93 86.36,88.9 87.63,90.17 90.45,90.17 91.44,91.16 S1.4 S1.3
RX_LED
  Top 1.27: R7.2 29.21,58.74 U$4.P22
SAFETY_STOP
  Top 1.27: U$4.P5 SV4.5
SMX_2B
  Top 1.27: JP1.1 16.51,10.71 16.54,10.74 16.54,20.34 20.32,24.13 U$1.P14
SPINDLE_ENABLE  (via drill 0.8)
  Top 1.27: SV3.1 U$4.P34 | R4.1 15.24,40.32 15.24,36.83 16.51,35.56 58.42,35.56 v59.69,36.83
  Bottom 1.27: v59.69,36.83 60.96,38.1 60.96,52.07 59.69,53.34 SV3.1
STEPPERS_DISABLE  (via drill 0.8)
  Top 1.27: U$1.P1 10.16,29.21 8.89,30.48 8.89,46.99 v13.97,52.07 | v17.14,67.82 17.91,67.82 21.34,71.24 v21.34,71.62 | U$3.P1 v63.38,29.21 | v30.4,16.43 30.4,25.16 34.29,29.06 34.88,29.06 35.03,29.21 U$2.P1
  Bottom 1.27: v13.97,52.07 13.97,64.03 17.45,67.51 v17.14,67.82 | v21.34,71.62 22.23,72.51 49.53,72.51 U$4.P11 | v63.38,29.21 60.96,31.63 60.96,31.75 55.88,31.75 52.07,27.94 50.8,27.94 49.53,29.21 U$2.P1 | U$1.P1 16.51,29.21 20.32,25.4 20.32,10.16 22.86,7.62 27.94,7.62 30.48,10.16 30.48,16.3 | 30.48,16.3 30.37,16.4 | v30.4,16.43 30.48,16.34 30.48,16.3
VDD
  Top 1.27: R3.2 43.18,49.53 44.45,50.8 T1.E
X_DIR  (via drill 0.8)
  Top 1.27: U$1.P8 v11.43,11.43 | v7.62,54.61 34.82,54.61 36.24,56.03 45.87,56.03 46.99,57.15 U$4.P29
  Bottom 1.27: v7.62,54.61 6.35,54.61 2.54,50.8 2.54,12.7 3.81,11.43 v11.43,11.43
X_STEP  (via drill 0.8)
  Top 1.27: U$1.P7 v11.43,13.97
  Bottom 1.27: v11.43,13.97 10.16,15.24 10.16,63.5 16.51,69.85 35.56,69.85 36.83,68.58 U$4.P25
Y_DIR  (via drill 0.8)
  Top 1.27: U$4.P30 49.53,55.88 v50.8,54.61 | v58.42,45.72 59.69,44.45 67.31,44.45 69.85,41.91 69.85,38.1 71.12,36.83 v82.55,36.83
  Bottom 1.27: v50.8,54.61 54.61,50.8 54.61,49.53 v58.42,45.72 | v82.55,36.83 85.09,34.29 85.09,12.7 83.82,11.43 U$3.P8
Y_STEP  (via drill 0.8)
  Top 1.27: U$3.P7 74.93,13.97 72.39,11.43 v67.31,11.43 | U$4.P26 v39.37,58.42
  Bottom 1.27: v67.31,11.43 65.15,13.59 65.15,31.37 62.23,34.29 58.42,34.29 57.15,35.56 57.15,38.1 55.88,39.37 55.88,40.64 54.61,41.91 54.61,45.72 52.07,48.26 40.64,48.26 39.37,49.53 v39.37,58.42
Z_DIR  (via drill 0.8)
  Top 1.27: v41.91,50.8 36.83,45.72 34.29,45.72 31.75,48.26 29.57,48.26 v29.39,48.08
  Bottom 1.27: U$2.P8 46.13,12.29 36.49,12.29 29.39,19.4 v29.39,48.08 | U$4.P31 51.21,66.22 51.21,65.5 41.91,56.2 v41.91,50.8
Z_STEP  (via drill 0.8)
  Top 1.27: U$2.P7 41.91,13.97 v40.64,15.24
  Bottom 1.27: v40.64,15.24 35.56,15.24 31.75,19.05 31.75,45.72 34.29,48.26 35.56,48.26 36.83,49.53 36.83,59.69 38.1,60.96 40.64,60.96 41.91,62.23 U$4.P27